# Altium schematic sheet Sheet2.SchDoc
size A4; SheetNumber: 1; SheetTotal: 1
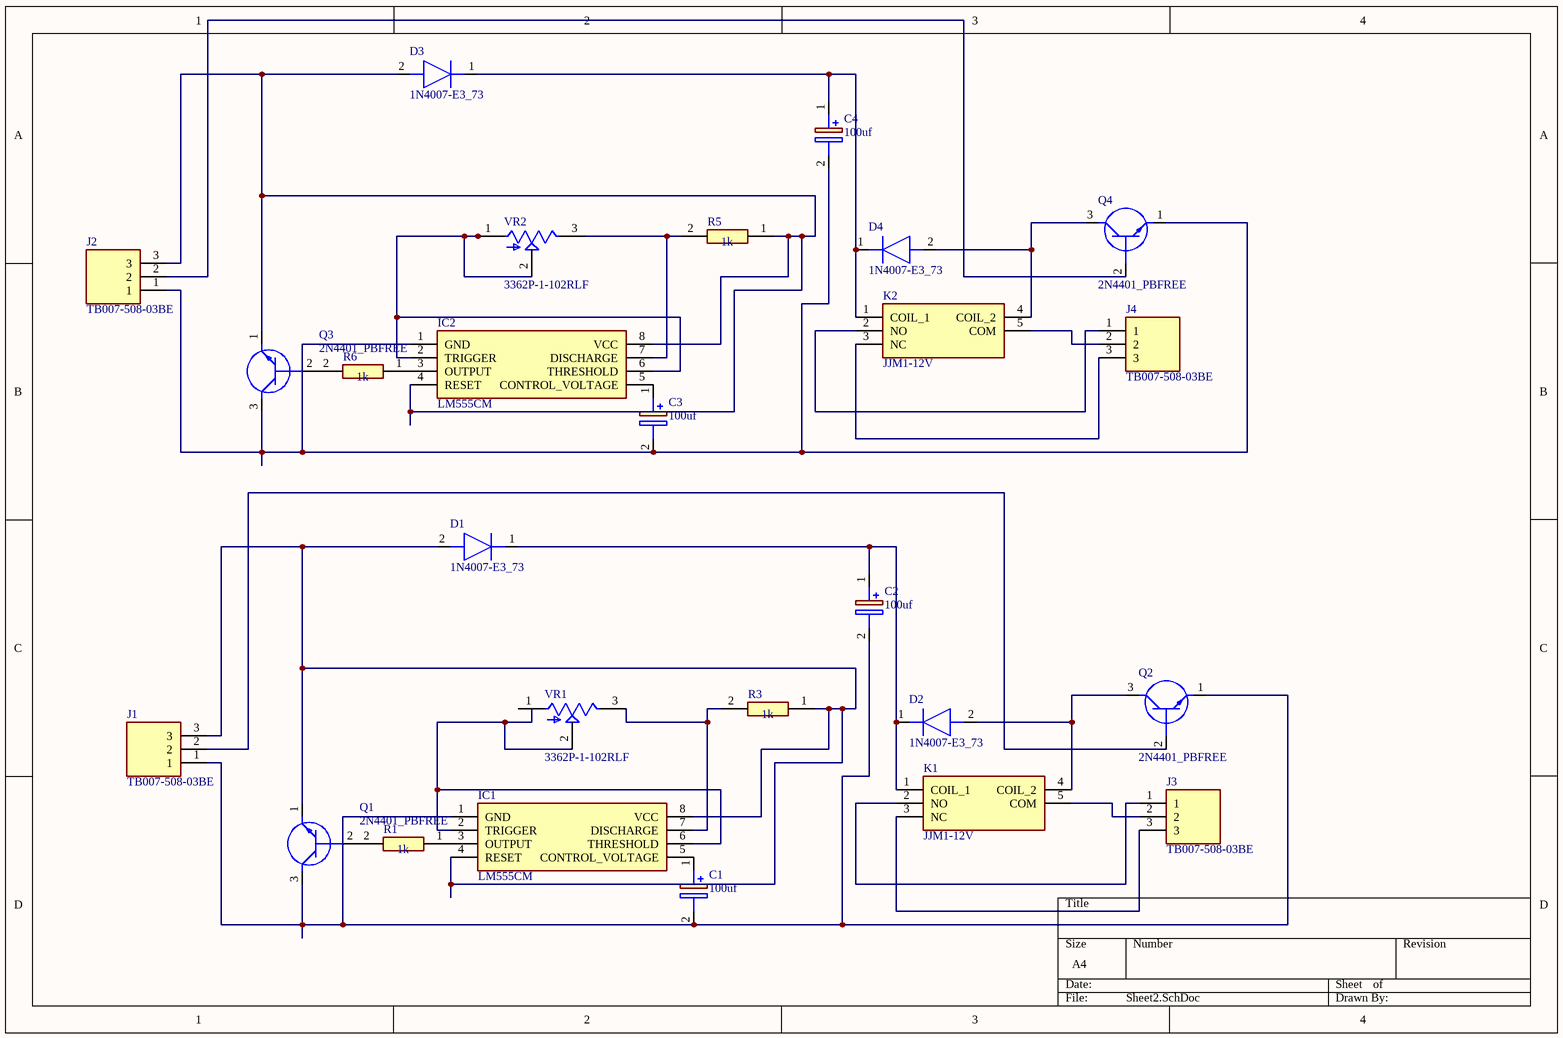
[diagram p0: Sheet2.SchDoc]

## Parts
C1  100uf  [CAPPRD500W65D1250H2700]
C2  100uf  [CAPPRD500W65D1250H2700]
C3  100uf  [CAPPRD500W65D1250H2700]
C4  100uf  [CAPPRD500W65D1250H2700]
D1  1N4007-E3_73  [DIOAD1405W86L465D235]
D2  1N4007-E3_73  [DIOAD1405W86L465D235]
D3  1N4007-E3_73  [DIOAD1405W86L465D235]
D4  1N4007-E3_73  [DIOAD1405W86L465D235]
IC1  LM555CM  [SOIC127P600X175-8N]
IC2  LM555CM  [SOIC127P600X175-8N]
J1  TB007-508-03BE  [CUI_TB007-508-03BE]
J2  TB007-508-03BE  [CUI_TB007-508-03BE]
J3  TB007-508-03BE  [CUI_TB007-508-03BE]
J4  TB007-508-03BE  [CUI_TB007-508-03BE]
K1  JJM1-12V  [JJM112V]
K2  JJM1-12V  [JJM112V]
Q1  2N4401_PBFREE  [2N4401PBFREE]
Q2  2N4401_PBFREE  [2N4401PBFREE]
Q3  2N4401_PBFREE  [2N4401PBFREE]
Q4  2N4401_PBFREE  [2N4401PBFREE]
R1  1k  [RESAD1987W56L1031D239]
R3  1k  [RESAD1987W56L1031D239]
R5  1k  [RESAD1987W56L1031D239]
R6  1k  [RESAD1987W56L1031D239]
VR1  3362P-1-102RLF  [TRIM_3362P-1-102RLF]
VR2  3362P-1-102RLF  [TRIM_3362P-1-102RLF]

## Nets
NetC1_1: C1.1(+) IC1.5(CONTROL_VOLTAGE)
NetC1_2: C1.2(-) C2.2(-) IC1.1(GND) J1.1 Q1.3(C) Q2.1(E)
NetC2_1: C2.1(+) D1.1(K) D2.1(K) K1.1(COIL_1)
NetC3_1: C3.1(+) IC2.5(CONTROL_VOLTAGE)
NetC3_2: C3.2(-) C4.2(-) IC2.1(GND) J2.1 Q3.3(C) Q4.1(E)
NetC4_1: C4.1(+) D3.1(K) D4.1(K) K2.1(COIL_1)
NetD1_2: D1.2(A) IC1.4(RESET) IC1.8(VCC) J1.3 Q1.1(E) R3.1
NetD2_2: D2.2(A) K1.4(COIL_2) Q2.3(C)
NetD3_2: D3.2(A) IC2.4(RESET) IC2.8(VCC) J2.3 Q3.1(E) R5.1
NetD4_2: D4.2(A) K2.4(COIL_2) Q4.3(C)
NetIC1_2: IC1.2(TRIGGER) IC1.6(THRESHOLD) VR1.2(WIPER)
NetIC1_3: IC1.3(OUTPUT) R1.1
NetIC1_7: IC1.7(DISCHARGE) R3.2 VR1.3(CW)
NetIC2_2: IC2.2(TRIGGER) IC2.6(THRESHOLD) VR2.1(CCW) VR2.2(WIPER)
NetIC2_3: IC2.3(OUTPUT) R6.1
NetIC2_7: IC2.7(DISCHARGE) R5.2 VR2.3(CW)
NetJ1_2: J1.2 Q2.2(B)
NetJ2_2: J2.2 Q4.2(B)
NetJ3_1: J3.1 K1.2(NO)
NetJ3_2: J3.2 K1.5(COM)
NetJ3_3: J3.3 K1.3(NC)
NetJ4_1: J4.1 K2.2(NO)
NetJ4_2: J4.2 K2.5(COM)
NetJ4_3: J4.3 K2.3(NC)
NetQ1_2: Q1.2(B) R1.2
NetQ3_2: Q3.2(B) R6.2

Not connected (* = marked no-connect by the designer): VR1 1(CCW)

## Library data of the parts
C1-C4 = EEUTA1E102LB: Capacitor Polarised; Manufacturer_Name: Panasonic; Datasheet Link: http://industrial.panasonic.com/cdbs/www-data/pdf/RDF0000/ABA0000C1212.pdf; Height: 27mm; Manufacturer_Part_Number: EEUTA1E102LB
D1-D4 = 1N4007-E3_73: Diode; Manufacturer_Name: Vishay; Manufacturer_Part_Number: 1N4007-E3/73; Datasheet Link: https://mouser.componentsearchengine.com/Datasheets/2/1N4007-E3_73.pdf; Mouser Part Number: 625-1N4007-E3/73; Mouser Price/Stock: https://www.mouser.co.uk/ProductDetail/Vishay-General-Semiconductor/1N4007-E3-73?qs=N4vtoAxH%2FSqT3Ng3e4K0Gw%3D%3D; Arrow Part Number: 1N4007-E3/73; Arrow Price/Stock: https://www.arrow.com/en/products/1n4007-e373/vishay?region=europe
IC1 IC2 = LM555CM: Integrated Circuit; Manufacturer_Name: onsemi; Datasheet Link: https://datasheet.datasheetarchive.com/originals/distributors/Datasheets_SAMA/3a16823a9a49147dced1d21a4d0c2297.pdf; Height: 1.75mm; Manufacturer_Part_Number: LM555CM; Mouser Part Number: 512-LM555CM; Mouser Price/Stock: https://www.mouser.co.uk/ProductDetail/onsemi-Fairchild/LM555CM?qs=4YdYnegEbZVLxPa60axfTg%3D%3D; Arrow Part Number: LM555CM; Arrow Price/Stock: https://www.arrow.com/en/products/lm555cm/on-semiconductor
K1 K2 = JJM1-12V: Relay or Contactor; Manufacturer_Name: Panasonic; Datasheet Link: https://www.panasonic-electric-works.com/cps/rde/xbcr/pew_eu_en/ds_61210_en_jjm.pdf; Height: 14.2mm; Manufacturer_Part_Number: JJM1-12V; Mouser Part Number: 769-JJM1-12V; Mouser Price/Stock: https://www.mouser.co.uk/ProductDetail/Panasonic-Industrial-Devices/JJM1-12V?qs=UO%2Fx91QLkSB08I34A9%2FECg%3D%3D; Arrow Part Number: JJM1-12V; Arrow Price/Stock: https://www.arrow.com/en/products/jjm1-12v/panasonic?region=nac
Q1-Q4 = 2N4401_PBFREE: Transistor BJT NPN; Manufacturer_Name: Central Semiconductor; Manufacturer_Part_Number: 2N4401 PBFREE; Datasheet Link: https://my.centralsemi.com/datasheets/2N4400.PDF; Height: 5.33mm; Mouser Part Number: 610-2N4401; Mouser Price/Stock: https://www.mouser.co.uk/ProductDetail/Central-Semiconductor/2N4401-PBFREE?qs=u16ybLDytRbENLVWEhN70w%3D%3D; Arrow Part Number: 2N4401 PBFREE; Arrow Price/Stock: https://www.arrow.com/en/products/2n4401-pbfree/central-semiconductor?region=nac
R1 R3 R5 R6 = RS01A1R000FE12: Resistor; Manufacturer_Name: Vishay; Datasheet Link: http://www.mouser.com/ds/2/427/rsns-226497.pdf; Manufacturer_Part_Number: RS01A1R000FE12; Mouser Part Number: 71-RS01A1R000FE12; Mouser Price/Stock: https://www.mouser.co.uk/ProductDetail/Vishay-Dale/RS01A1R000FE12?qs=pX8%252BLszEE6SqU%2F4VU%252B6gEw%3D%3D; Arrow Part Number: RS01A1R000FE12; Arrow Price/Stock: https://www.arrow.com/en/products/rs01a1r000fe12/vishay?region=nac
VR1 VR2 = 3362P-1-102RLF: 1 kOhms 0.5W, 1/2W PC Pins Through Hole Trimmer Potentiometer Cermet 1 Turn Top Adjustment; MF: Bourns; Value: *; Check_prices: https://www.snapeda.com/parts/3362P-1-102RLF/Bourns/view-part/1439351/?ref=eda; Availability: Good; Package: 3362P-1 Bourns Inc.; SnapEDA_Link: https://www.snapeda.com/parts/3362P-1-102RLF/Bourns/view-part/1439351/?ref=snap; Purchase-URL: https://pricing.snapeda.com/search/part/3362P-1-102RLF/?ref=eda; Price: None; MP: 3362P-1-102RLF
J1-J4 = TB007-508-03BE: Availability: Unavailable; MP: TB007-508-03BE; Price: None; Value: *; Package: None